# Altium schematic sheet 12_TEC.SchDoc
size 420 x 297 mm; SheetNumber: 20; SheetTotal: 24
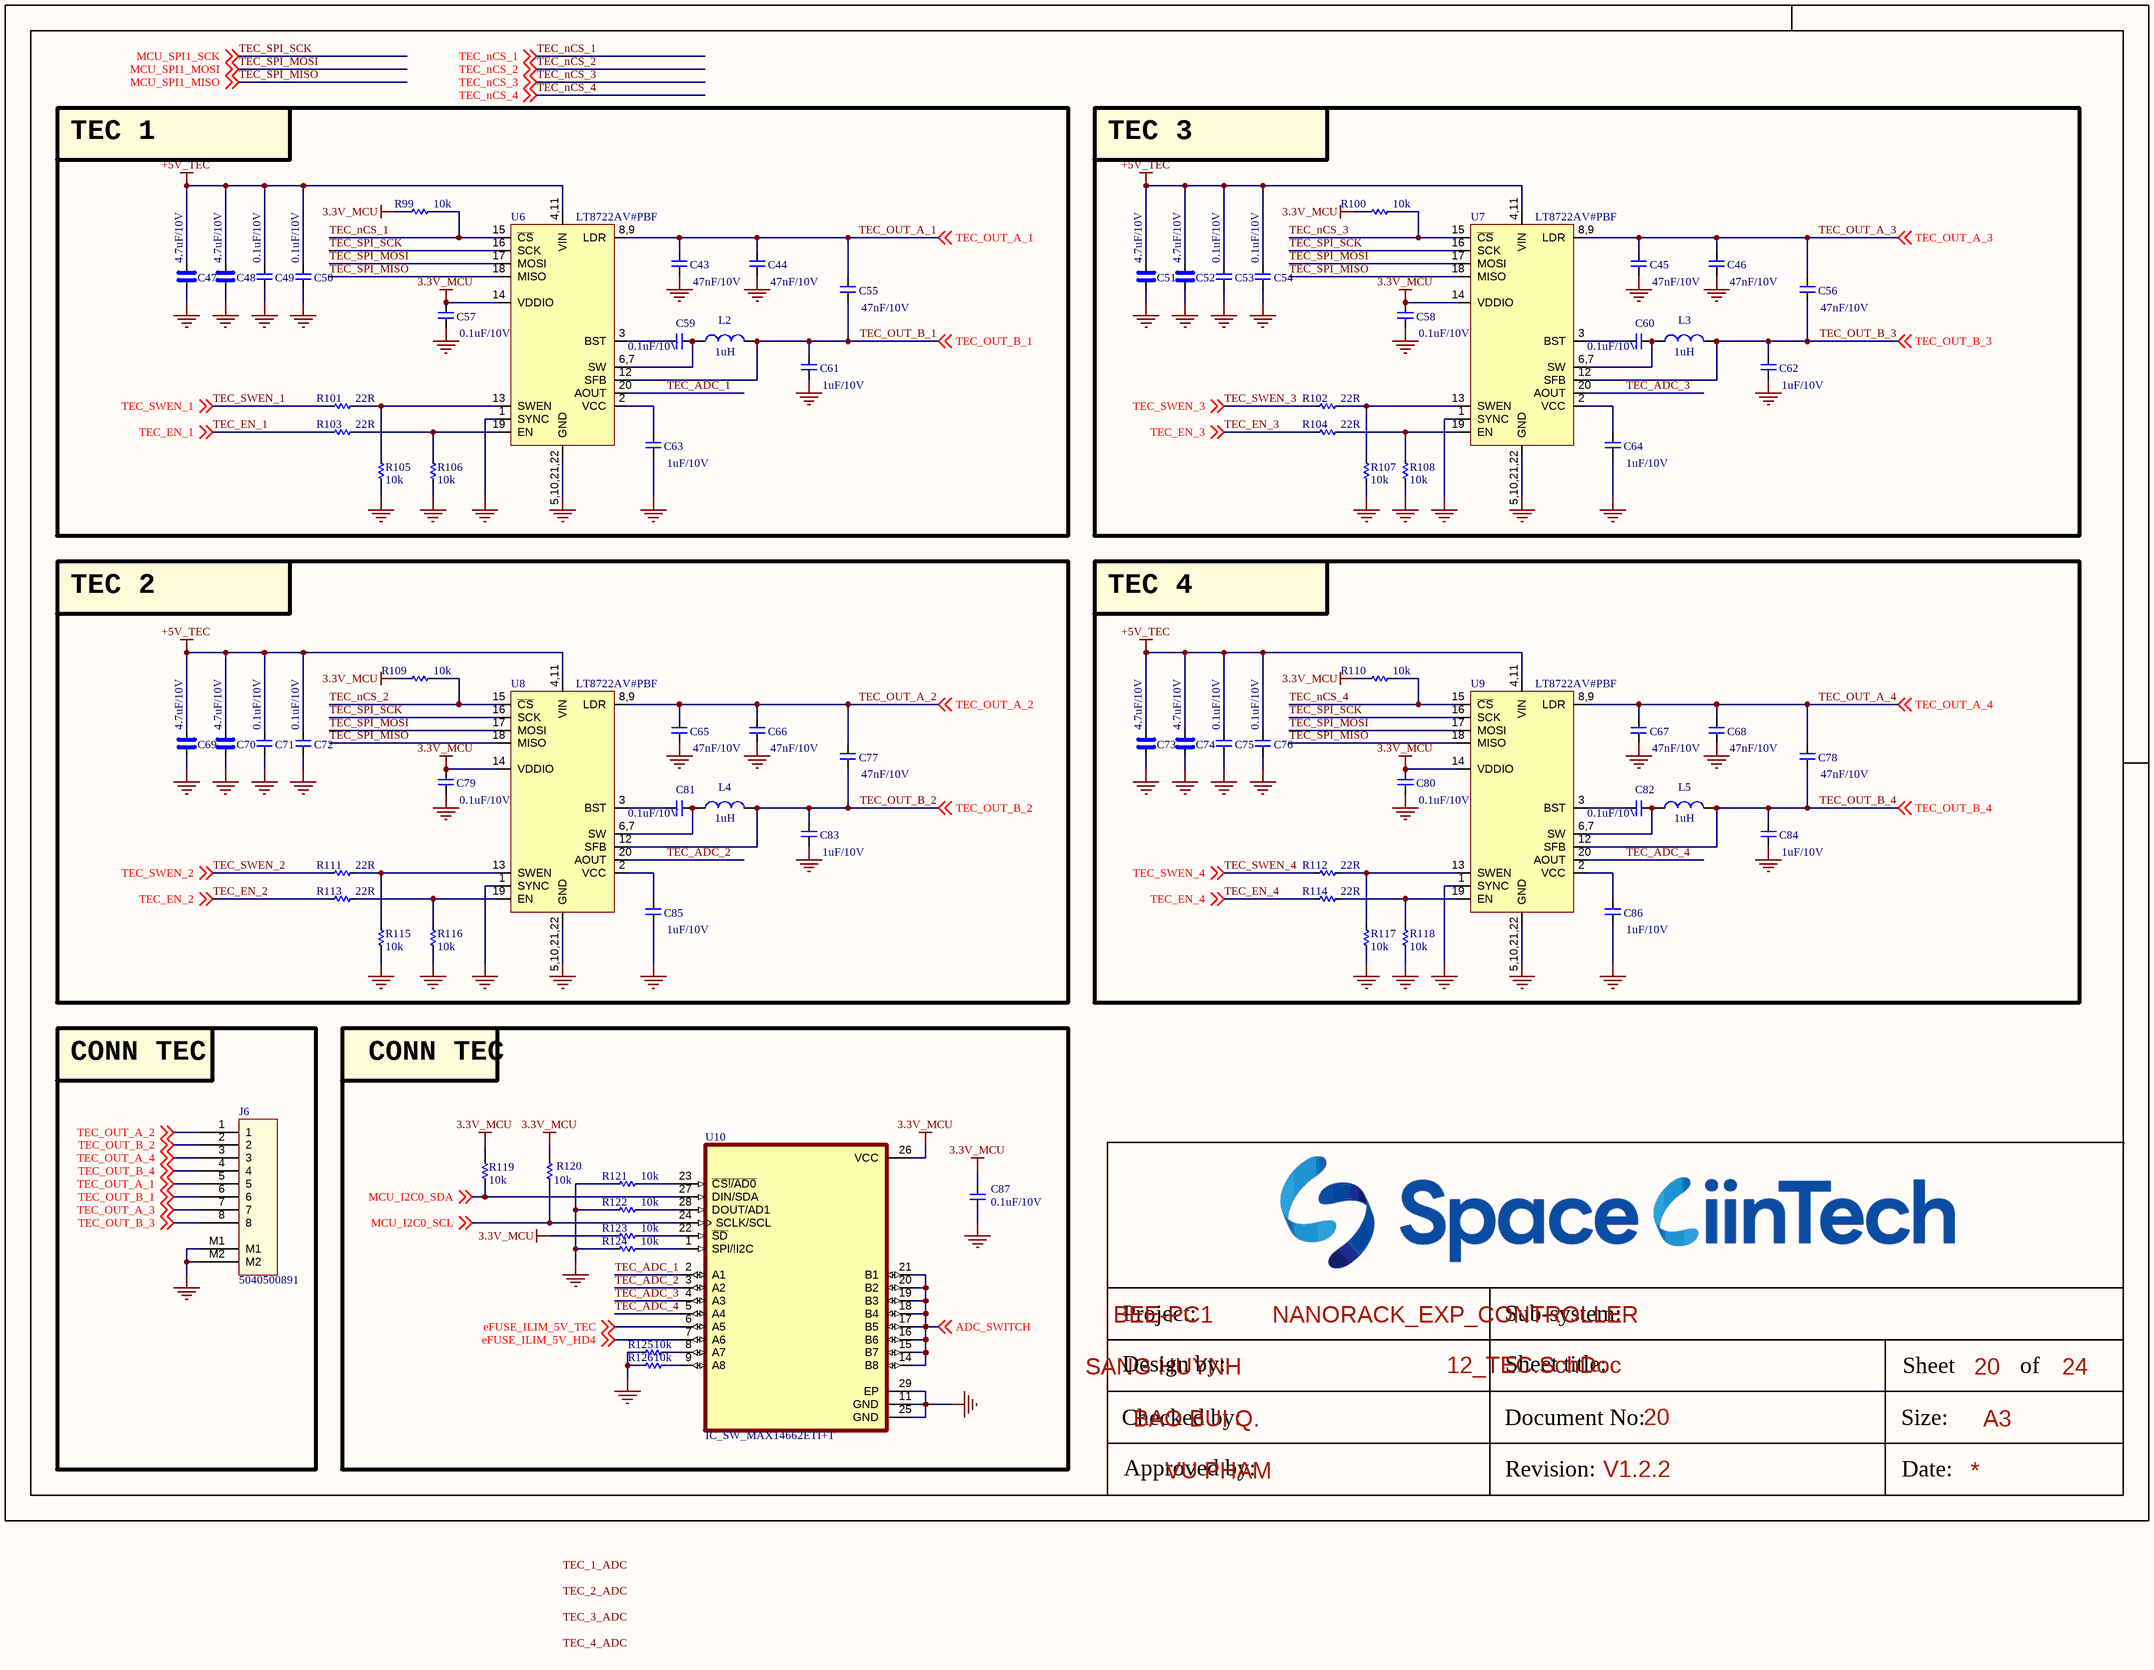
[diagram p0: 12_TEC.SchDoc]

## Parts
C43  47nF/10V  [CAP_C_1005X60]
C44  47nF/10V  [CAP_C_1005X60]
C45  47nF/10V  [CAP_C_1005X60]
C46  47nF/10V  [CAP_C_1005X60]
C47  4.7uF/10V  [CAP_C_1608X80]
C48  4.7uF/10V  [CAP_C_1608X80]
C49  0.1uF/10V  [CAP_C_1005X60]
C50  0.1uF/10V  [CAP_C_1005X60]
C51  4.7uF/10V  [CAP_C_1608X80]
C52  4.7uF/10V  [CAP_C_1608X80]
C53  0.1uF/10V  [CAP_C_1005X60]
C54  0.1uF/10V  [CAP_C_1005X60]
C55  47nF/10V  [CAP_C_1005X60]
C56  47nF/10V  [CAP_C_1005X60]
C57  0.1uF/10V  [CAP_C_1005X60]
C58  0.1uF/10V  [CAP_C_1005X60]
C59  0.1uF/10V  [CAP_C_1005X60]
C60  0.1uF/10V  [CAP_C_1005X60]
C61  1uF/10V  [CAP_C_1005X60]
C62  1uF/10V  [CAP_C_1005X60]
C63  1uF/10V  [CAP_C_1005X60]
C64  1uF/10V  [CAP_C_1005X60]
C65  47nF/10V  [CAP_C_1005X60]
C66  47nF/10V  [CAP_C_1005X60]
C67  47nF/10V  [CAP_C_1005X60]
C68  47nF/10V  [CAP_C_1005X60]
C69  4.7uF/10V  [CAP_C_1608X80]
C70  4.7uF/10V  [CAP_C_1608X80]
C71  0.1uF/10V  [CAP_C_1005X60]
C72  0.1uF/10V  [CAP_C_1005X60]
C73  4.7uF/10V  [CAP_C_1608X80]
C74  4.7uF/10V  [CAP_C_1608X80]
C75  0.1uF/10V  [CAP_C_1005X60]
C76  0.1uF/10V  [CAP_C_1005X60]
C77  47nF/10V  [CAP_C_1005X60]
C78  47nF/10V  [CAP_C_1005X60]
C79  0.1uF/10V  [CAP_C_1005X60]
C80  0.1uF/10V  [CAP_C_1005X60]
C81  0.1uF/10V  [CAP_C_1005X60]
C82  0.1uF/10V  [CAP_C_1005X60]
C83  1uF/10V  [CAP_C_1005X60]
C84  1uF/10V  [CAP_C_1005X60]
C85  1uF/10V  [CAP_C_1005X60]
C86  1uF/10V  [CAP_C_1005X60]
C87  0.1uF/10V  [CAP_C_1005X60]
J6  5040500891  [MOLEX_5040500891]
L2  1uH  [L-SMD-M-3.5x3.5x2mm]
L3  1uH  [L-SMD-M-3.5x3.5x2mm]
L4  1uH  [L-SMD-M-3.5x3.5x2mm]
L5  1uH  [L-SMD-M-3.5x3.5x2mm]
R99  10k  [RES_C_1005X40]
R100  10k  [RES_C_1005X40]
R101  22R  [RES_C_1005X40]
R102  22R  [RES_C_1005X40]
R103  22R  [RES_C_1005X40]
R104  22R  [RES_C_1005X40]
R105  10k  [RES_C_1005X40]
R106  10k  [RES_C_1005X40]
R107  10k  [RES_C_1005X40]
R108  10k  [RES_C_1005X40]
R109  10k  [RES_C_1005X40]
R110  10k  [RES_C_1005X40]
R111  22R  [RES_C_1005X40]
R112  22R  [RES_C_1005X40]
R113  22R  [RES_C_1005X40]
R114  22R  [RES_C_1005X40]
R115  10k  [RES_C_1005X40]
R116  10k  [RES_C_1005X40]
R117  10k  [RES_C_1005X40]
R118  10k  [RES_C_1005X40]
R119  10k  [RES_C_1005X40]
R120  10k  [RES_C_1005X40]
R121  10k  [RES_C_1005X40]
R122  10k  [RES_C_1005X40]
R123  10k  [RES_C_1005X40]
R124  10k  [RES_C_1005X40]
R125  10k  [RES_C_1005X40]
R126  10k  [RES_C_1005X40]
U6  LT8722AV#PBF  [QFN18]
U7  LT8722AV#PBF  [QFN18]
U8  LT8722AV#PBF  [QFN18]
U9  LT8722AV#PBF  [QFN18]
U10  IC_SW_MAX14662ETI+T  [QFN40P400X400X80-29N]

## Blocks framed on the sheet
TEC 1: C43 C44 C47-C50 C55 C57 C59 C61 C63 L2 R99 R101 R103 R105 R106 U6
TEC 3: C45 C46 C51-C54 C56 C58 C60 C62 C64 L3 R100 R102 R104 R107 R108 U7
TEC 2: C65 C66 C69-C72 C77 C79 C81 C83 C85 L4 R109 R111 R113 R115 R116 U8
TEC 4: C67 C68 C73-C76 C78 C80 C82 C84 C86 L5 R110 R112 R114 R117 R118 U9
CONN TEC: J6
CONN TEC: C87 R119-R126 U10

## Nets
3.3V_MCU: C57.2 C58.2 C79.2 C80.2 C87.2 R99.1 R100.1 R109.1 R110.1 R119.2 R120.2 R123.1 U6.14(VDDIO) U7.14(VDDIO) U8.14(VDDIO) U9.14(VDDIO) U10.26(VCC)
+5V_TEC: C47.2 C48.2 C49.2 C50.2 C51.2 C52.2 C53.2 C54.2 C69.2 C70.2 C71.2 C72.2 C73.2 C74.2 C75.2 C76.2 U6.4,11(VIN) U7.4,11(VIN) U8.4,11(VIN) U9.4,11(VIN)
GND: C43.1 C44.1 C45.1 C46.1 C47.1 C48.1 C49.1 C50.1 C51.1 C52.1 C53.1 C54.1 C57.1 C58.1 C61.1 C62.1 C63.1 C64.1 C65.1 C66.1 C67.1 C68.1 C69.1 C70.1 C71.1 C72.1 C73.1 C74.1 C75.1 C76.1 C79.1 C80.1 C83.1 C84.1 C85.1 C86.1 C87.1 J6.M1 J6.M2 R105.2 R106.2 R107.2 R108.2 R115.2 R116.2 R117.2 R118.2 R121.1 R122.1 R124.1 R125.1 R126.1 U6.1(SYNC) U6.5,10,21,22(GND) U7.1(SYNC) U7.5,10,21,22(GND) U8.1(SYNC) U8.5,10,21,22(GND) U9.1(SYNC) U9.5,10,21,22(GND) U10.11(GND) U10.25(GND) U10.29(EP)
ADC_SWITCH: U10.14(B8) U10.15(B7) U10.16(B6) U10.17(B5) U10.18(B4) U10.19(B3) U10.20(B2) U10.21(B1) ; off-sheet ADC_SWITCH
eFUSE_ILIM_5V_HD4: U10.7(A6) ; off-sheet eFUSE_ILIM_5V_HD4
eFUSE_ILIM_5V_TEC: U10.6(A5) ; off-sheet eFUSE_ILIM_5V_TEC
MCU_I2C0_SCL: R120.1 U10.24(SCLK/SCL) ; off-sheet MCU_I2C0_SCL
MCU_I2C0_SDA: R119.1 U10.27(DIN/SDA) ; off-sheet MCU_I2C0_SDA
TEC_ADC_1: U6.20(AOUT) U10.2(A1)
TEC_ADC_2: U8.20(AOUT) U10.3(A2)
TEC_ADC_3: U7.20(AOUT) U10.4(A3)
TEC_ADC_4: U9.20(AOUT) U10.5(A4)
TEC_EN_1: R103.2 ; off-sheet TEC_EN_1
TEC_EN_2: R113.2 ; off-sheet TEC_EN_2
TEC_EN_3: R104.2 ; off-sheet TEC_EN_3
TEC_EN_4: R114.2 ; off-sheet TEC_EN_4
TEC_nCS_1: R99.2 U6.15(~{CS}) ; off-sheet TEC_nCS_1
TEC_nCS_2: R109.2 U8.15(~{CS}) ; off-sheet TEC_nCS_2
TEC_nCS_3: R100.2 U7.15(~{CS}) ; off-sheet TEC_nCS_3
TEC_nCS_4: R110.2 U9.15(~{CS}) ; off-sheet TEC_nCS_4
TEC_OUT_A_1: C43.2 C44.2 C55.2 J6.5 U6.8,9(LDR) ; off-sheet TEC_OUT_A_1
TEC_OUT_A_2: C65.2 C66.2 C77.2 J6.1 U8.8,9(LDR) ; off-sheet TEC_OUT_A_2
TEC_OUT_A_3: C45.2 C46.2 C56.2 J6.7 U7.8,9(LDR) ; off-sheet TEC_OUT_A_3
TEC_OUT_A_4: C67.2 C68.2 C78.2 J6.3 U9.8,9(LDR) ; off-sheet TEC_OUT_A_4
TEC_OUT_B_1: C55.1 C61.2 J6.6 L2.2 U6.12(SFB) ; off-sheet TEC_OUT_B_1
TEC_OUT_B_2: C77.1 C83.2 J6.2 L4.2 U8.12(SFB) ; off-sheet TEC_OUT_B_2
TEC_OUT_B_3: C56.1 C62.2 J6.8 L3.2 U7.12(SFB) ; off-sheet TEC_OUT_B_3
TEC_OUT_B_4: C78.1 C84.2 J6.4 L5.2 U9.12(SFB) ; off-sheet TEC_OUT_B_4
TEC_SPI_MISO: U6.18(MISO) U7.18(MISO) U8.18(MISO) U9.18(MISO) ; off-sheet MCU_SPI1_MISO  [also labelled MCU_SPI1_MISO]
TEC_SPI_MOSI: U6.17(MOSI) U7.17(MOSI) U8.17(MOSI) U9.17(MOSI) ; off-sheet MCU_SPI1_MOSI  [also labelled MCU_SPI1_MOSI]
TEC_SPI_SCK: U6.16(SCK) U7.16(SCK) U8.16(SCK) U9.16(SCK) ; off-sheet MCU_SPI1_SCK  [also labelled MCU_SPI1_SCK]
TEC_SWEN_1: R101.1 ; off-sheet TEC_SWEN_1
TEC_SWEN_2: R111.1 ; off-sheet TEC_SWEN_2
TEC_SWEN_3: R102.1 ; off-sheet TEC_SWEN_3
TEC_SWEN_4: R112.1 ; off-sheet TEC_SWEN_4
NetC59_1: C59.1 L2.1 U6.6,7(SW)
NetC59_2: C59.2 U6.3(BST)
NetC60_1: C60.1 L3.1 U7.6,7(SW)
NetC60_2: C60.2 U7.3(BST)
NetC63_2: C63.2 U6.2(VCC)
NetC64_2: C64.2 U7.2(VCC)
NetC81_1: C81.1 L4.1 U8.6,7(SW)
NetC81_2: C81.2 U8.3(BST)
NetC82_1: C82.1 L5.1 U9.6,7(SW)
NetC82_2: C82.2 U9.3(BST)
NetC85_2: C85.2 U8.2(VCC)
NetC86_2: C86.2 U9.2(VCC)
NetR101_2: R101.2 R105.1 U6.13(SWEN)
NetR102_2: R102.2 R107.1 U7.13(SWEN)
NetR103_1: R103.1 R106.1 U6.19(EN)
NetR104_1: R104.1 R108.1 U7.19(EN)
NetR111_2: R111.2 R115.1 U8.13(SWEN)
NetR112_2: R112.2 R117.1 U9.13(SWEN)
NetR113_1: R113.1 R116.1 U8.19(EN)
NetR114_1: R114.1 R118.1 U9.19(EN)
NetR121_2: R121.2 U10.23(~{CS!/AD0})
NetR122_2: R122.2 U10.28(DOUT/AD1)
NetR123_2: R123.2 U10.22(~{SD})
NetR124_2: R124.2 U10.1(SPI/!I2C)
NetR125_2: R125.2 U10.8(A7)
NetR126_2: R126.2 U10.9(A8)

## Notes on the sheet
- Labels drawn without touching a wire or pin: TEC_1_ADC, TEC_2_ADC, TEC_3_ADC, TEC_4_ADC
- Project:
- BEE-PC1
- Sub-system:
- NANORACK_EXP_CONTROLLER
- Design by:
- SANG HUYNH
- BAO BUI Q.
- Sheet title:
- Sheet
- A3
- of
- Checked by:
- Approved by:
- VU PHAM
- Revision:
- Document No:
- V1.2.2
- Size:
- Date:

## Library data of the parts
C43-C46 C49 C50 C53-C68 C71 C72 C75-C87 = _CAP_C_2: CAP CHIP
C47 C48 C51 C52 C69 C70 C73 C74 = _CAP_C_High_2: CAP CHIP High Value
J6 = Header 8x1_2M
L2-L5 = L-SMD-1: partNo: 78477010; Manufacturer: Wurth Elektronik; Inductance: 1.0 μH; ComponentLink1Description: Manufacturer; ComponentLink1URL: http://www.we-online.de; Created by: Baojun Chen; Created Date: Nov.2015; ComponentLink2Description: Datasheet; ComponentLink2URL: http://katalog.we-online.de/pbs/datasheet/78477010.pdf
R99-R126 = _RES_B_2: RES
U6-U9 = LT8722
U10 = IC_SW_MAX14662ETI+T: 8 Circuit IC Switch 1:1 1Ohm 28-TQFN _4x4_; MF: Maxim Integrated; Package: TQFN-28 Maxim; Value: *; Price: None; MP: MAX14662ETI+T; SnapEDA_Link: https://www.snapeda.com/parts/MAX14662ETI%2BT/Maxim%20Integrated/view-part/546683/?ref=snap; Availability: Unavailable